# EAGLE design Emoji Board v3 (EAGLE 7.5.0)
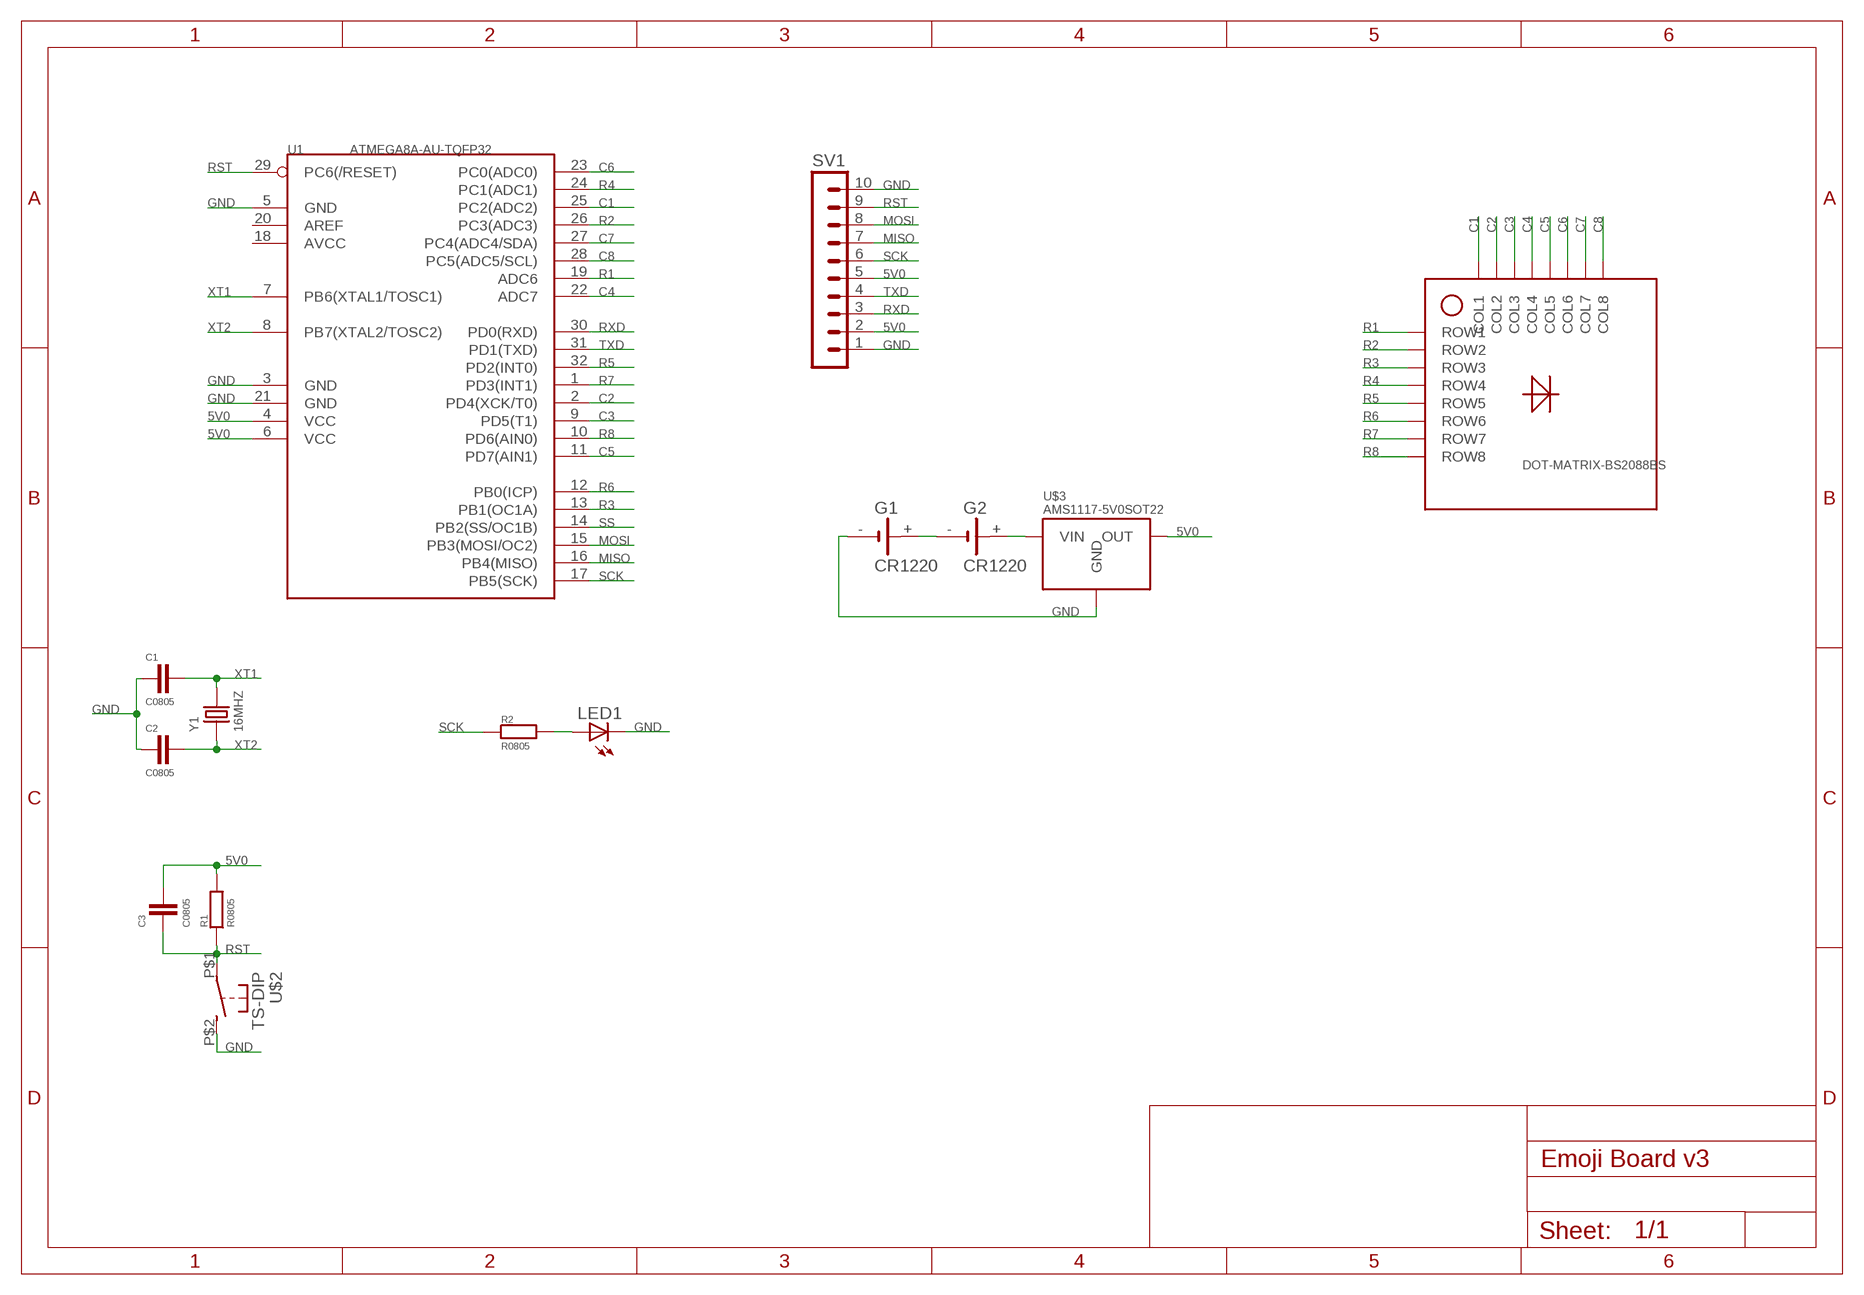
[diagram p0: schematic, sheet 1]

## Parts
C1  C0805  [C0805]
C2  C0805  [C0805]
C3  C0805  [C0805]
G1  CR1220  [CR1220]
G2  CR1220  [CR1220]
LED1  LEDCHIPLED_0805  [LED0805]
R1  R0805  [R0805]
R2  R0805  [R0805]
SV1  MA10-1W  [MA10-1W]
U1  ATMEGA8A-AU-TQFP32  ATMEGA8A-AU  [TQFP32]
U$1  DOT-MATRIX-BS2088BS  [2088BS]
U$2  TS-DIP  [TS-DIP]
U$3  AMS1117-5V0SOT22  [SOT223]
Y1  16MHZ  DIP-CRYSTAL-16MHZ-18PF-30PPM-40R(HC49US)  [HC49US]

## Nets
5V0: C3.1 R1.2 SV1.2 SV1.5 U1.4(VCC) U1.6(VCC) U$3.OUT
C1: U1.25(PC2(ADC2)) U$1.COL1
C2: U1.2(PD4(XCK/T0)) U$1.COL2
C3: U1.9(PD5(T1)) U$1.COL3
C4: U1.22(ADC7) U$1.COL4
C5: U1.11(PD7(AIN1)) U$1.COL5
C6: U1.23(PC0(ADC0)) U$1.COL6
C7: U1.27(PC4(ADC4/SDA)) U$1.COL7
C8: U1.28(PC5(ADC5/SCL)) U$1.COL8
GND: C1.2 C2.2 G1.- LED1.C SV1.1 SV1.10 U1.3(GND) U1.5(GND) U1.21(GND) U$2.P$2(S) U$3.GND
MISO: SV1.7 U1.16(PB4(MISO))
MOSI: SV1.8 U1.15(PB3(MOSI/OC2))
N$1: LED1.A R2.2
N$2: G1.+ G2.-
N$3: G2.+ U$3.VIN
R1: U1.19(ADC6) U$1.ROW1
R2: U1.26(PC3(ADC3)) U$1.ROW2
R3: U1.13(PB1(OC1A)) U$1.ROW3
R4: U1.24(PC1(ADC1)) U$1.ROW4
R5: U1.32(PD2(INT0)) U$1.ROW5
R6: U1.12(PB0(ICP)) U$1.ROW6
R7: U1.1(PD3(INT1)) U$1.ROW7
R8: U1.10(PD6(AIN0)) U$1.ROW8
RST: C3.2 R1.1 SV1.9 U1.29(PC6(/RESET)) U$2.P$1(P)
RXD: SV1.3 U1.30(PD0(RXD))
SCK: R2.1 SV1.6 U1.17(PB5(SCK))
SS: U1.14(PB2(SS/OC1B))
TXD: SV1.4 U1.31(PD1(TXD))
XT1: C1.1 U1.7(PB6(XTAL1/TOSC1)) Y1.2
XT2: C2.1 U1.8(PB7(XTAL2/TOSC2)) Y1.1
Unconnected: U1.18(AVCC) U1.20(AREF)

## Library data of the parts
C1-C3 = RCLDA:C: CAPACITOR
G1 G2 = Power:CR1220: Battery Holder, SMT, 12mm multicomp PART NO. CH291-1220LF Source: Data sheet <http://www.farnell.com/datasheets/1505860.pdf>
LED1 = Display:LED
R1 R2 = RCLDA:R: RESISTOR
SV1 = Pin-Header:MA10-1W: PIN HEADER; OC_FARNELL: unknown; OC_NEWARK: unknown
U1 = Chip:ATMEGA8A-AU: 310010023; MPN: ATMEGA8A-AU
U$1 = Display:DOT-MATRIX-BS
U$2 = Button:TS-DIP
U$3 = Chip:AMS1117-5V0
Y1 = Crystal:DIP-CRYSTAL-16MHZ-18PF-30PPM-40R(HC49US): 306010014; MPN: HC-49US 16.000MHz

## Board
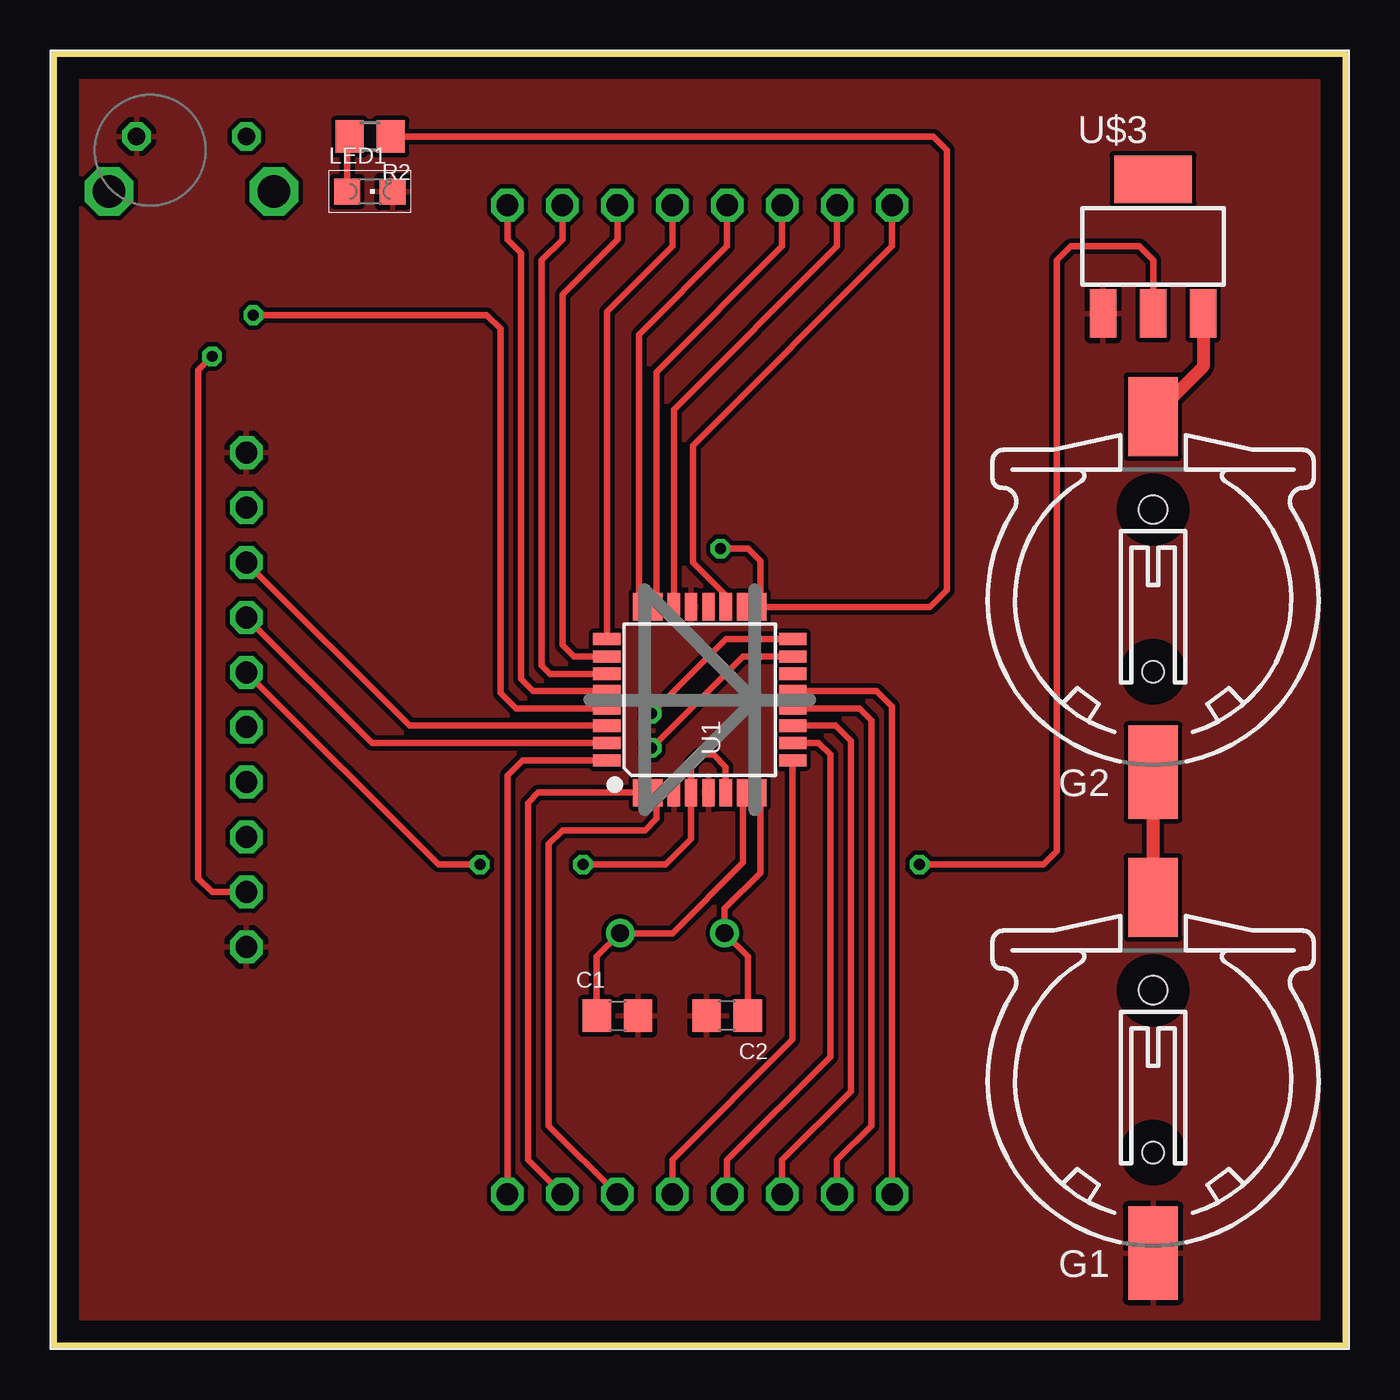
[diagram p1: board, top side]
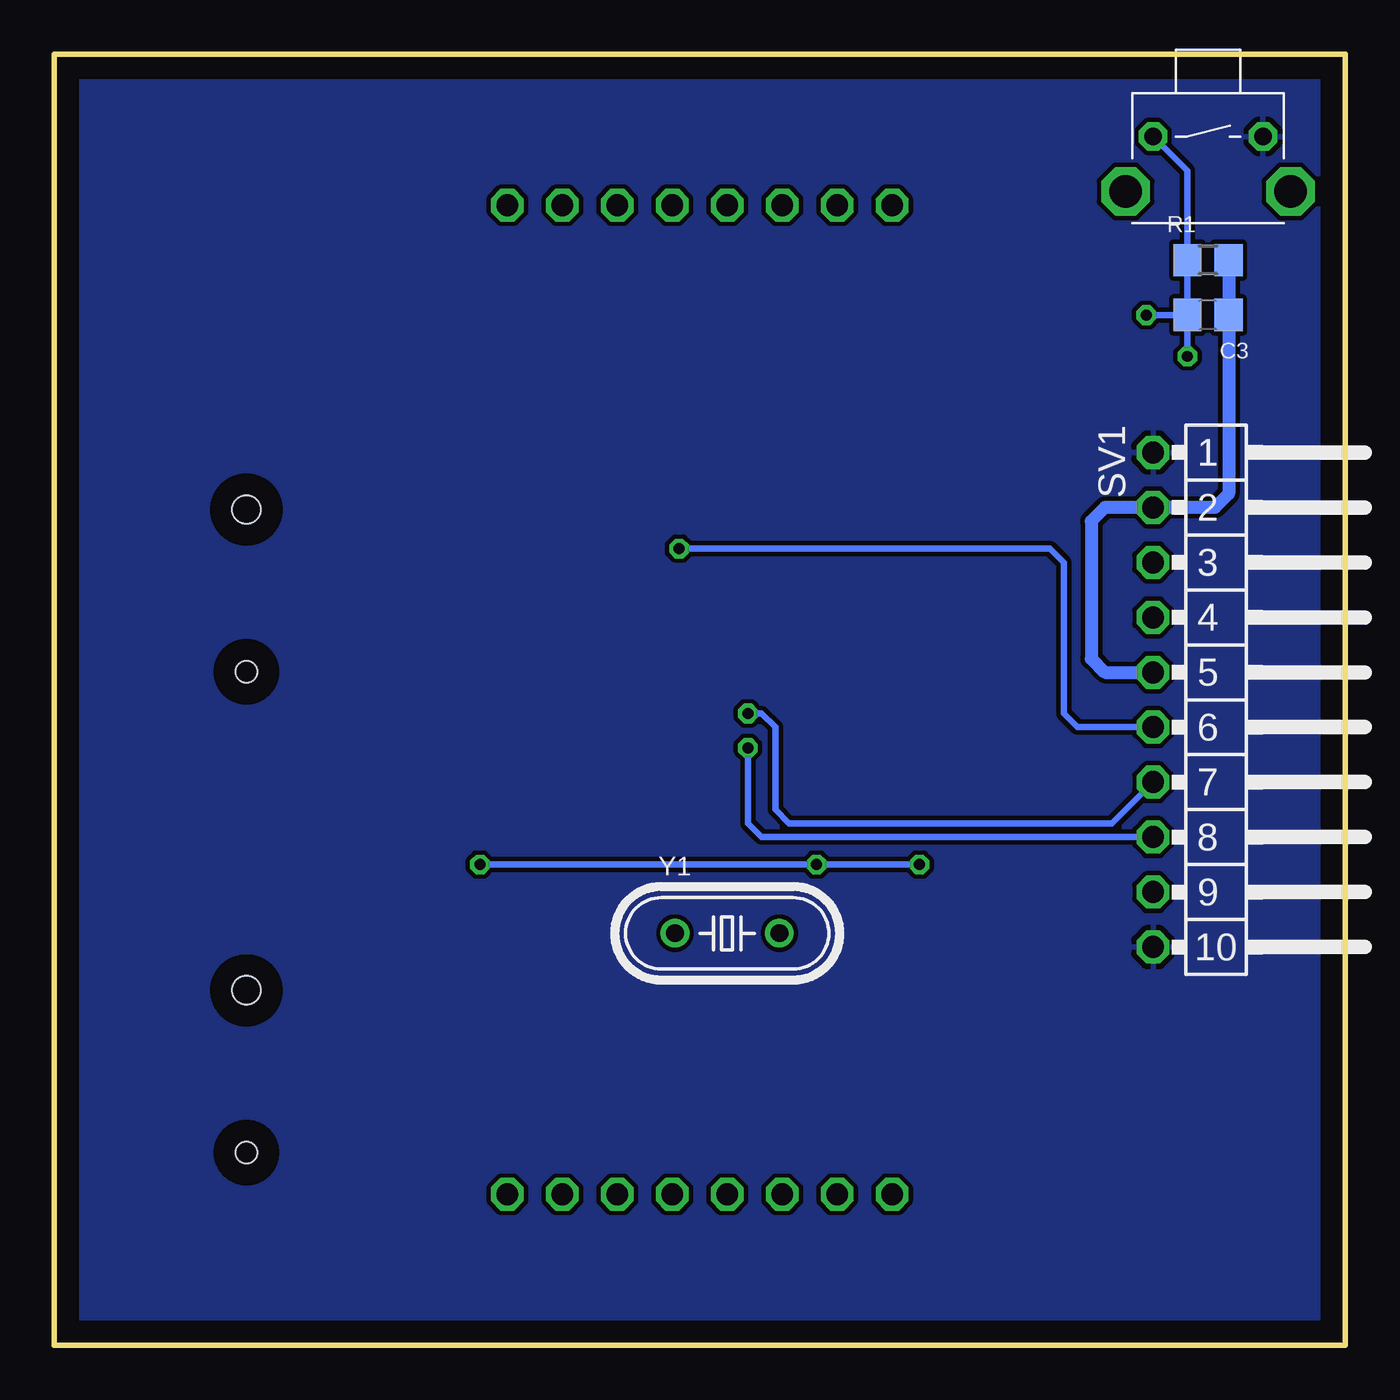
[diagram p2: board, bottom side, seen from below]

Size 59.69 x 59.69 mm. Coordinates in mm from the lower left corner, seen from the top.
Outline: 0,0 59.69,0 59.69,59.69 0,59.69 0,0
Copper layers (1*16): Top 0.035mm / dielectric 1.5mm / Bottom 0.035mm
Design rules "default": minimum track width 10mil, minimum drill 24mil, track to track 8mil, track to pad 8mil, pad to pad 8mil, via to via 8mil, smd to smd 8mil, copper to edge 40mil, drill to drill 8mil, minimum pad ring 10mil, minimum via ring 8mil, stop-mask expansion 4mil, vias tented up to drill 0mil, thermal gap 10mil

### Footprints (pad centres in the part's own frame; a part is rotated, then mirrored left to right if it is on the bottom)
C0805 = smd 1.3 x 1.5: 1 -0.95,0; 2 0.95,0
CR1220 = smd 2.3 x 3.66: + 0,-2.296 | smd 2.3 x 4.3: - 0,14.146 | hole 1.3: 0,2 | hole 1: 0,9.5
LED0805 = smd 1.2 x 1.2: A -1.05,0; C 1.05,0
R0805 = smd 1.3 x 1.5: 1 -0.95,0; 2 0.95,0
MA10-1W = drill 1.016 octagon: 1 -11.43,0; 2 -8.89,0; 3 -6.35,0; 4 -3.81,0; 5 -1.27,0; 6 1.27,0; 7 3.81,0; 8 6.35,0; 9 8.89,0; 10 11.43,0
TQFP32 = smd 1.27 x 0.559: 1 -4.293,2.8; 2 -4.293,2; 3 -4.293,1.2; 4 -4.293,0.4; 5 -4.293,-0.4; 6 -4.293,-1.2; 7 -4.293,-2; 8 -4.293,-2.8; 17 4.293,-2.8; 18 4.293,-2; 19 4.293,-1.2; 20 4.293,-0.4; 21 4.293,0.4; 22 4.293,1.2; 23 4.293,2; 24 4.293,2.8 | smd 0.559 x 1.27: 9 -2.8,-4.293; 10 -2,-4.293; 11 -1.2,-4.293; 12 -0.4,-4.293; 13 0.4,-4.293; 14 1.2,-4.293; 15 2,-4.293; 16 2.8,-4.293; 25 2.8,4.293; 26 2,4.293; 27 1.2,4.293; 28 0.4,4.293; 29 -0.4,4.293; 30 -1.2,4.293; 31 -2,4.293; 32 -2.8,4.293
2088BS = drill 1 octagon: COL1 -1.27,22.86; COL2 -3.81,-22.86; COL3 -1.27,-22.86; COL4 6.35,22.86; COL5 3.81,-22.86; COL6 3.81,22.86; COL7 -6.35,22.86; COL8 -8.89,22.86; ROW1 8.89,22.86; ROW2 -3.81,22.86; ROW3 8.89,-22.86; ROW4 1.27,22.86; ROW5 -8.89,-22.86; ROW6 6.35,-22.86; ROW7 -6.35,-22.86; ROW8 1.27,-22.86
TS-DIP = drill 0.8 octagon: P$1 -2.54,0; P$2 2.54,0 | drill 1.5 octagon: P$3 -3.81,-2.54; P$4 3.81,-2.54
SOT223 = smd 3.6 x 2.2: 4 0,3.099 | smd 1.219 x 2.235: GND -2.311,-3.099; OUT 0,-3.099; VIN 2.311,-3.099
HC49US = drill 0.813: 1 -2.413,0; 2 2.413,0

### Placement (x,y rotation side)
C1  26.04,15.24 0 top
C2  31.11,15.24 180 top
C3  6.35,47.62 180 bottom
G1  50.8,18.41 180 top
G2  50.8,40.64 180 top
LED1  14.6,53.34 0 top
R1  6.35,50.16 0 bottom
R2  14.6,55.88 180 top
SV1  8.89,29.84 270 bottom
U1  29.84,29.84 90 top
U$1  29.84,29.84 0 top
U$2  6.35,55.88 0 bottom
U$3  50.8,50.8 0 top
Y1  28.57,19.05 0 bottom

### Tracks (layer width: path | path; a pad name or v marks a point on that pad's centre or on a via)
5V0  (via drill 0.5)
  Top 0.305: v24.45,22.22 28.26,22.22 29.45,23.41 U1.4 29.45,26.9 29.84,27.3 30.48,27.3 31.04,26.74 U1.6 | v19.68,22.22 17.78,22.22 SV1.5 | U$3.OUT 50.8,50.16 50.16,50.8 46.99,50.8 46.36,50.16 46.36,22.86 45.72,22.22 v40,22.22
  Bottom 0.305: v19.68,22.22 v24.45,22.22 v40,22.22
  Bottom 0.61: R1.2 C3.1 5.4,39.37 6.03,38.73 SV1.2 11.11,38.73 11.75,38.1 11.75,31.75 11.11,31.11 SV1.5
C1
  Top 0.305: U1.25 25.55,47.78 28.57,50.8 U$1.COL1
C2
  Top 0.305: U1.2 27.84,24.35 27.3,23.81 23.49,23.81 22.86,23.18 22.86,10.16 U$1.COL2
C3
  Top 0.305: U1.9 34.14,14.13 28.57,8.57 U$1.COL3
C4
  Top 0.305: U1.22 28.64,43.25 36.2,50.8 U$1.COL4
C5
  Top 0.305: U1.11 36.12,28.64 36.83,27.94 36.83,11.75 33.66,8.57 U$1.COL5
C6
  Top 0.305: U1.23 27.84,44.99 33.66,50.8 U$1.COL6
C7
  Top 0.305: U1.27 22.93,31.04 22.54,31.43 22.54,50.16 23.49,51.12 U$1.COL7
C8
  Top 0.305: U1.28 22.14,30.24 21.59,30.8 21.59,50.48 20.95,51.12 U$1.COL8
GND
  pour Top: 0,0 59.69,0 59.69,59.69 0,59.69
  pour Bottom: 0,0 59.69,0 59.69,59.69 0,59.69
MISO  (via drill 0.5)
  Top 0.305: U1.16 31.06,32.64 v27.62,29.21
  Bottom 0.305: v27.62,29.21 26.99,29.21 26.35,28.57 26.35,24.77 25.72,24.13 10.79,24.13 SV1.7
MOSI  (via drill 0.5)
  Top 0.305: U1.15 31.84,31.84 v27.62,27.62
  Bottom 0.305: v27.62,27.62 27.62,24.13 26.99,23.49 SV1.8
N$1
  Top 0.305: LED1.A 13.55,55.78 R2.2
N$2
  Top 0.61: G1.+ G2.-
N$3
  Top 0.61: U$3.VIN 53.11,45.25 G2.+
R1
  Top 0.305: U1.19 31.04,34.68 29.53,36.2 29.53,41.59 38.73,50.8 U$1.ROW1
R2
  Top 0.305: U1.26 24.04,31.84 23.49,32.38 23.49,48.58 26.04,51.12 U$1.ROW2
R3
  Top 0.305: U1.13 38.02,30.24 38.73,29.53 U$1.ROW3
R4
  Top 0.305: U1.24 27.04,46.73 31.11,50.8 U$1.ROW4
R5
  Top 0.305: U1.32 21.65,27.04 20.95,26.35 U$1.ROW5
R6
  Top 0.305: U1.12 37.23,29.45 37.78,28.89 37.78,10.16 36.2,8.57 U$1.ROW6
R7
  Top 0.305: U1.1 22.38,25.55 21.91,25.08 21.91,8.57 U$1.ROW7
R8
  Top 0.305: U1.10 35.34,27.84 35.88,27.3 35.88,13.33 31.11,8.57 U$1.ROW8
RST  (via drill 0.5)
  Top 0.305: U1.29 21.35,29.45 20.64,30.16 20.64,46.99 20,47.62 v9.21,47.62 | SV1.9 7.3,20.95 6.67,21.59 6.67,45.09 v7.3,45.72
  Bottom 0.305: U$2.P$1 7.3,54.29 R1.1 C3.2 | v9.21,47.62 C3.2 | v7.3,45.72 C3.2
RXD
  Top 0.305: U1.30 16.44,28.64 SV1.3
SCK  (via drill 0.5)
  Top 0.305: v30.8,36.83 32.07,36.83 32.64,36.25 U1.17 40.49,34.14 41.27,34.92 41.27,55.24 40.64,55.88 R2.1
  Bottom 0.305: v30.8,36.83 13.65,36.83 13.02,36.2 13.02,29.21 12.38,28.57 SV1.6
TXD
  Top 0.305: U1.31 14.7,27.84 SV1.4
XT1
  Top 0.305: U1.7 31.84,22.32 28.57,19.05 Y1.2 25.09,17.97 C1.1
XT2
  Top 0.305: U1.8 32.64,21.85 30.99,20.19 Y1.1 32.06,17.97 C2.1